# Altium schematic sheet ARM_PCB.SchDoc
size A3
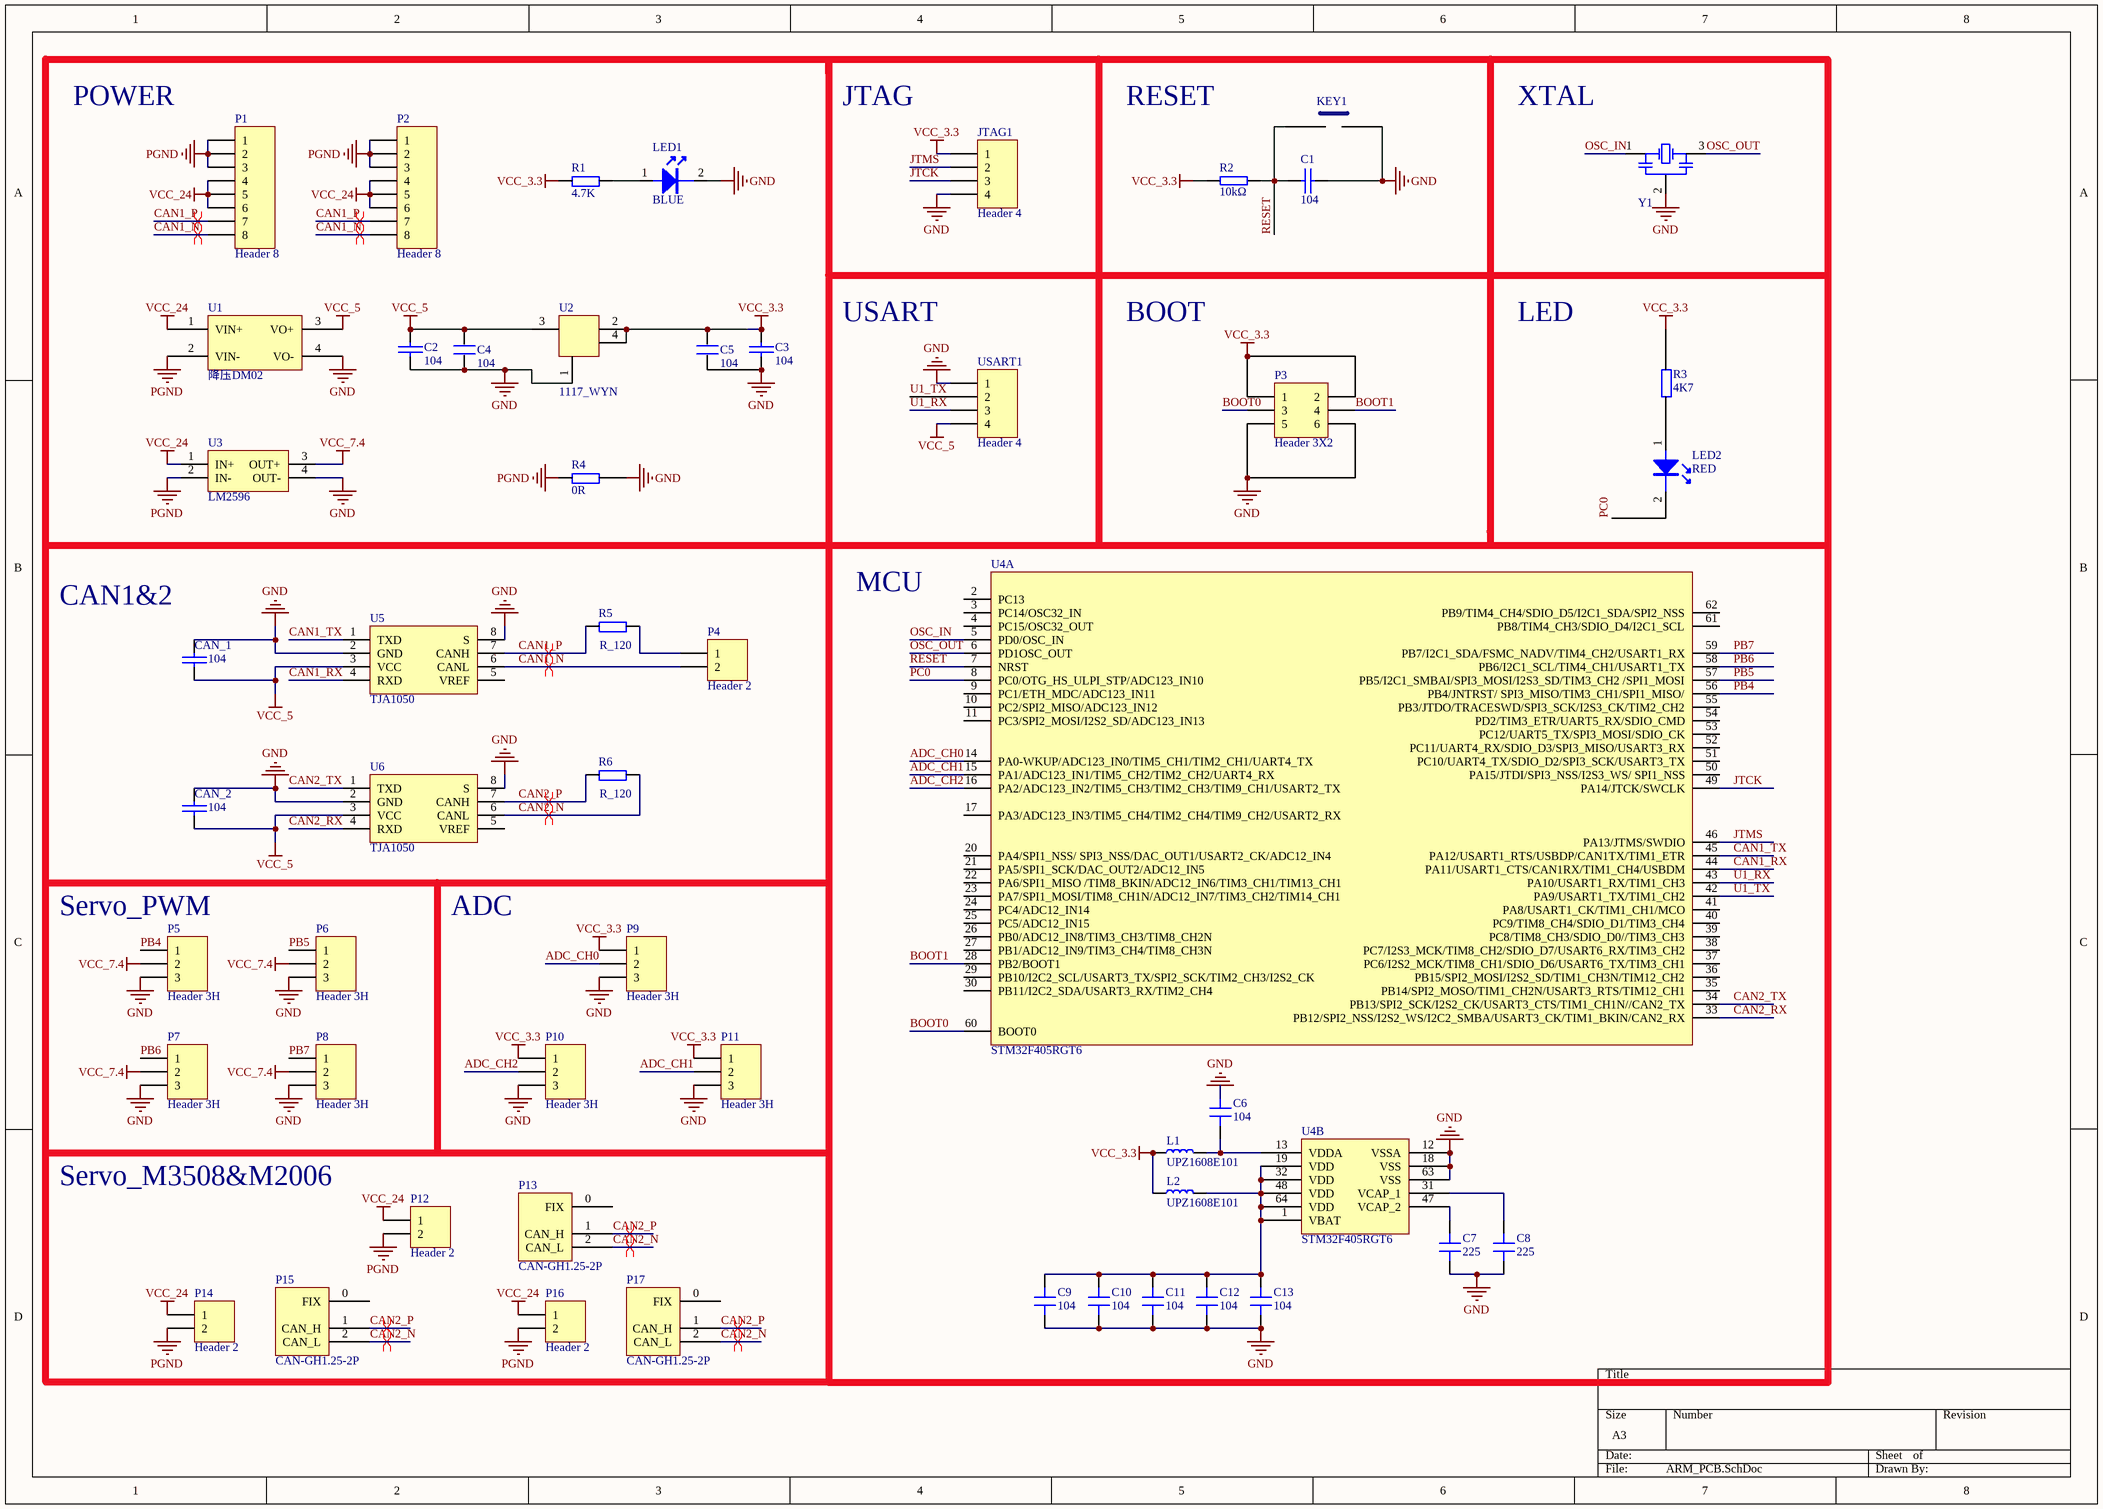
[diagram p0: ARM_PCB.SchDoc]

## Parts
C1  104  [C0603]
C2  104  [C0603]
C3  104  [C0603]
C4  104  [C0603]
C5  104  [C0603]
C6  104  [C0603/1608]
C7  225  [C0603/1608]
C8  225  [C0603/1608]
C9  104  [C0603/1608]
C10  104  [C0603/1608]
C11  104  [C0603/1608]
C12  104  [C0603/1608]
C13  104  [C0603/1608]
CAN_1  104  [C0603]
CAN_2  104  [C0603]
JTAG1  Header 4  [Header1*4_XH2.54_zhi]
KEY1  KEY2  [KEY_RESET]  (value not drawn)
L1  UPZ1608E101  [L0603/1608]
L2  UPZ1608E101  [L0603/1608]
LED1  Color: BLUE  [LED0603]  (hidden comment: LED BLUE)
LED2  Color: RED  [LED0603]  (hidden comment: LED RED)
P1  Header 8  [Header1*8_XH2.54_zhi]
P2  Header 8  [Header1*8_XH2.54_zhi]
P3  Header 3X2  [BOOT]
P4  Header 2  [TM]
P5  Header 3H  [Header1*3XH2.54]
P6  Header 3H  [Header1*3XH2.54]
P7  Header 3H  [Header1*3XH2.54]
P8  Header 3H  [Header1*3XH2.54]
P9  Header 3H  [Header1*3XH2.54]
P10  Header 3H  [Header1*3XH2.54]
P11  Header 3H  [Header1*3XH2.54]
P12  Header 2  [XT30_母]
P13  CAN-GH1.25-2P  [GH1.25-2P（立式）]
P14  Header 2  [XT30_母]
P15  CAN-GH1.25-2P  [GH1.25-2P（立式）]
P16  Header 2  [XT30_母]
P17  CAN-GH1.25-2P  [GH1.25-2P（立式）]
R1  4.7K  [R0603]
R2  10kΩ  [R0603]
R3  4K7  [R0603]
R4  0R  [R0603]
R5  R_120  [R0603]
R6  R_120  [R0603]
U1  降压DM02  [降压DM02]
U2  1117_WYN  [SOT-223]
U3  LM2596  [LM2596_big]
U4  STM32F405RGT6  [LQFP64]  (parts A,B of 2)
U5  TJA1050  [SO8_M]
U6  TJA1050  [SO8_M]
USART1  Header 4  [Header1*4_XH2.54_zhi]
Y1  Crystal_Cap  [XTAL-3213]  (value not drawn)

## Nets
GND: C1.2 C2.2 C3.2 C4.1 C5.1 C6.2 C7.1 C8.1 C9.1 C10.1 C11.1 C12.1 C13.1 CAN_1.1 CAN_2.1 JTAG1.4 KEY1.1 LED1.2(K) P3.5 P3.6 P5.3 P6.3 P7.3 P8.3 P9.3 P10.3 P11.3 R4.2 U1.4(VO-) U2.1 U3.4(OUT-) U4.12(VSSA) U4.18(VSS) U4.63(VSS) U5.2(GND) U5.8(S) U6.2(GND) U6.8(S) USART1.1 Y1.2(OSC2)
PGND: P1.1 P1.2 P1.3 P2.1 P2.2 P2.3 P12.2 P14.2 P16.2 R4.1 U1.2(VIN-) U3.2(IN-)
VCC_3.3: C3.1 C5.2 JTAG1.1 L1.1 L2.1 P3.1 P3.2 P9.1 P10.1 P11.1 R1.1 R2.2 R3.2 U2.2 U2.4
VCC_5: C2.1 C4.2 CAN_1.2 CAN_2.2 U1.3(VO+) U2.3 U5.3(VCC) U6.3(VCC) USART1.4
VCC_7.4: P5.2 P6.2 P7.2 P8.2 U3.3(OUT+)
VCC_24: P1.4 P1.5 P1.6 P2.4 P2.5 P2.6 P12.1 P14.1 P16.1 U1.1(VIN+) U3.1(IN+)
ADC_CH0: P9.2 U4.14(PA0-WKUP/ADC123_IN0/TIM5_CH1/TIM2_CH1/UART4_TX)
ADC_CH1: P11.2 U4.15(PA1/ADC123_IN1/TIM5_CH2/TIM2_CH2/UART4_RX)
ADC_CH2: P10.2 U4.16(PA2/ADC123_IN2/TIM5_CH3/TIM2_CH3/TIM9_CH1/USART2_TX)
BOOT0: P3.3 U4.60(BOOT0)
BOOT1: P3.4 U4.28(PB2/BOOT1)
CAN1_N: P1.8 P2.8 P4.2 U5.6(CANL)
CAN1_P: P1.7 P2.7 R5.1 U5.7(CANH)
CAN1_RX: U4.44(PA11/USART1_CTS/CAN1RX/TIM1_CH4/USBDM) U5.4(RXD)
CAN1_TX: U4.45(PA12/USART1_RTS/USBDP/CAN1TX/TIM1_ETR) U5.1(TXD)
CAN2_N: P13.2(CAN_L) P15.2(CAN_L) P17.2(CAN_L) R6.2 U6.6(CANL)
CAN2_P: P13.1(CAN_H) P15.1(CAN_H) P17.1(CAN_H) R6.1 U6.7(CANH)
CAN2_RX: U4.33(PB12/SPI2_NSS/I2S2_WS/I2C2_SMBA/USART3_CK/TIM1_BKIN/CAN2_RX) U6.4(RXD)
CAN2_TX: U4.34(PB13/SPI2_SCK/I2S2_CK/USART3_CTS/TIM1_CH1N//CAN2_TX) U6.1(TXD)
JTCK: JTAG1.3 U4.49(PA14/JTCK/SWCLK)
JTMS: JTAG1.2 U4.46(PA13/JTMS/SWDIO)
OSC_IN: U4.5(PD0/OSC_IN) Y1.1(OSC1)
OSC_OUT: U4.6(PD1OSC_OUT) Y1.3(OSC3)
PB4: P5.1 U4.56(PB4/JNTRST/_SPI3_MISO/TIM3_CH1/SPI1_MISO/)
PB5: P6.1 U4.57(PB5/I2C1_SMBAI/SPI3_MOSI/I2S3_SD/TIM3_CH2_/SPI1_MOSI)
PB6: P7.1 U4.58(PB6/I2C1_SCL/TIM4_CH1/USART1_TX)
PB7: P8.1 U4.59(PB7/I2C1_SDA/FSMC_NADV/TIM4_CH2/USART1_RX)
PC0: LED2.2(K) U4.8(PC0/OTG_HS_ULPI_STP/ADC123_IN10)
RESET: C1.1 KEY1.2 R2.1 U4.7(NRST)
U1_RX: U4.43(PA10/USART1_RX/TIM1_CH3) USART1.3
U1_TX: U4.42(PA9/USART1_TX/TIM1_CH2) USART1.2
NetC6_1: C6.1 L1.2 U4.13(VDDA)
NetC7_2: C7.2 U4.47(VCAP_2)
NetC8_2: C8.2 U4.31(VCAP_1)
NetC9_2: C9.2 C10.2 C11.2 C12.2 C13.2 L2.2 U4.1(VBAT) U4.19(VDD) U4.32(VDD) U4.48(VDD) U4.64(VDD)
NetLED1_1: LED1.1(A) R1.2
NetLED2_1: LED2.1(A) R3.1
NetP4_1: P4.1 R5.2

Not connected (* = marked no-connect by the designer): P13 0(FIX); P15 0(FIX); P17 0(FIX); U4 2(PC13) 3(PC14/OSC32_IN) 4(PC15/OSC32_OUT) 9(PC1/ETH_MDC/ADC123_IN11) 10(PC2/SPI2_MISO/ADC123_IN12) 11(PC3/SPI2_MOSI/I2S2_SD/ADC123_IN13) 17(PA3/ADC123_IN3/TIM5_CH4/TIM2_CH4/TIM9_CH2/USART2_RX) 20(PA4/SPI1_NSS/_SPI3_NSS/DAC_OUT1/USART2_CK/ADC12_IN4) 21(PA5/SPI1_SCK/DAC_OUT2/ADC12_IN5) 22(PA6/SPI1_MISO_/TIM8_BKIN/ADC12_IN6/TIM3_CH1/TIM13_CH1) 23(PA7/SPI1_MOSI/TIM8_CH1N/ADC12_IN7/TIM3_CH2/TIM14_CH1) 24(PC4/ADC12_IN14) 25(PC5/ADC12_IN15) 26(PB0/ADC12_IN8/TIM3_CH3/TIM8_CH2N) 27(PB1/ADC12_IN9/TIM3_CH4/TIM8_CH3N) 29(PB10/I2C2_SCL/USART3_TX/SPI2_SCK/TIM2_CH3/I2S2_CK) 30(PB11/I2C2_SDA/USART3_RX/TIM2_CH4) 35(PB14/SPI2_MOSO/TIM1_CH2N/USART3_RTS/TIM12_CH1) 36(PB15/SPI2_MOSI/I2S2_SD/TIM1_CH3N/TIM12_CH2) 37(PC6/I2S2_MCK/TIM8_CH1/SDIO_D6/USART6_TX/TIM3_CH1) 38(PC7/I2S3_MCK/TIM8_CH2/SDIO_D7/USART6_RX/TIM3_CH2) 39(PC8/TIM8_CH3/SDIO_D0//TIM3_CH3) 40(PC9/TIM8_CH4/SDIO_D1/TIM3_CH4) 41(PA8/USART1_CK/TIM1_CH1/MCO) 50(PA15/JTDI/SPI3_NSS/I2S3_WS/_SPI1_NSS) 51(PC10/UART4_TX/SDIO_D2/SPI3_SCK/USART3_TX) 52(PC11/UART4_RX/SDIO_D3/SPI3_MISO/USART3_RX) 53(PC12/UART5_TX/SPI3_MOSI/SDIO_CK) 54(PD2/TIM3_ETR/UART5_RX/SDIO_CMD) 55(PB3/JTDO/TRACESWD/SPI3_SCK/I2S3_CK/TIM2_CH2) 61(PB8/TIM4_CH3/SDIO_D4/I2C1_SCL) 62(PB9/TIM4_CH4/SDIO_D5/I2C1_SDA/SPI2_NSS); U5 5(VREF); U6 5(VREF)

## Layout directives
differential pair: CAN1_N, CAN1_P, CAN2_N, CAN2_P

## Notes on the sheet
- POWER
- JTAG
- RESET
- XTAL
- USART
- BOOT
- LED
- CAN1&2
- MCU
- (near P5) Servo_PWM
- ADC
- Servo_M3508&M2006

## Library data of the parts
C1-C3 CAN_1 CAN_2 = CAP_WYN
C4 C5 = Cap
C6-C13 = 陶瓷电容
JTAG1 USART1 = Header 4: Header, 4-Pin; LatestRevisionDate: 17-Jul-2002; LatestRevisionNote: Re-released for DXP Platform.; Publisher: Altium Limited
KEY1 = KEY
L1 L2 = 磁珠: 贴片磁珠
LED1 LED2 = LED
P1 P2 = Header 8: Header, 8-Pin; LatestRevisionDate: 17-Jul-2002; LatestRevisionNote: Re-released for DXP Platform.; Publisher: Altium Limited
P3 = Header 3X2: Header, 3-Pin, Dual row; LatestRevisionDate: 17-Jul-2002; LatestRevisionNote: Re-released for DXP Platform.; Publisher: Altium Limited
P13 P15 P17 = CAN-GH1.25-2P: CAN-GH1.25-2P端子座
R1 R5 R6 = R
R2 = RES_WYN
R3 R4 = Resistor
U3 = DC-DC稳压模块: 云辉 LM2596S DC-DC降压电源模块
U4 = STM32F405RGT6: 微控制器STM32F405RGT6
Y1 = Crystal_Cap: Published: 8-Jun-2000; LatestRevisionDate: 17-Jul-2002; LatestRevisionNote: Re-released for DXP Platform.; Publisher: Altium Limited